# EAGLE design PiInTheSky-Mainboard-v0.5 (EAGLE 6.4)
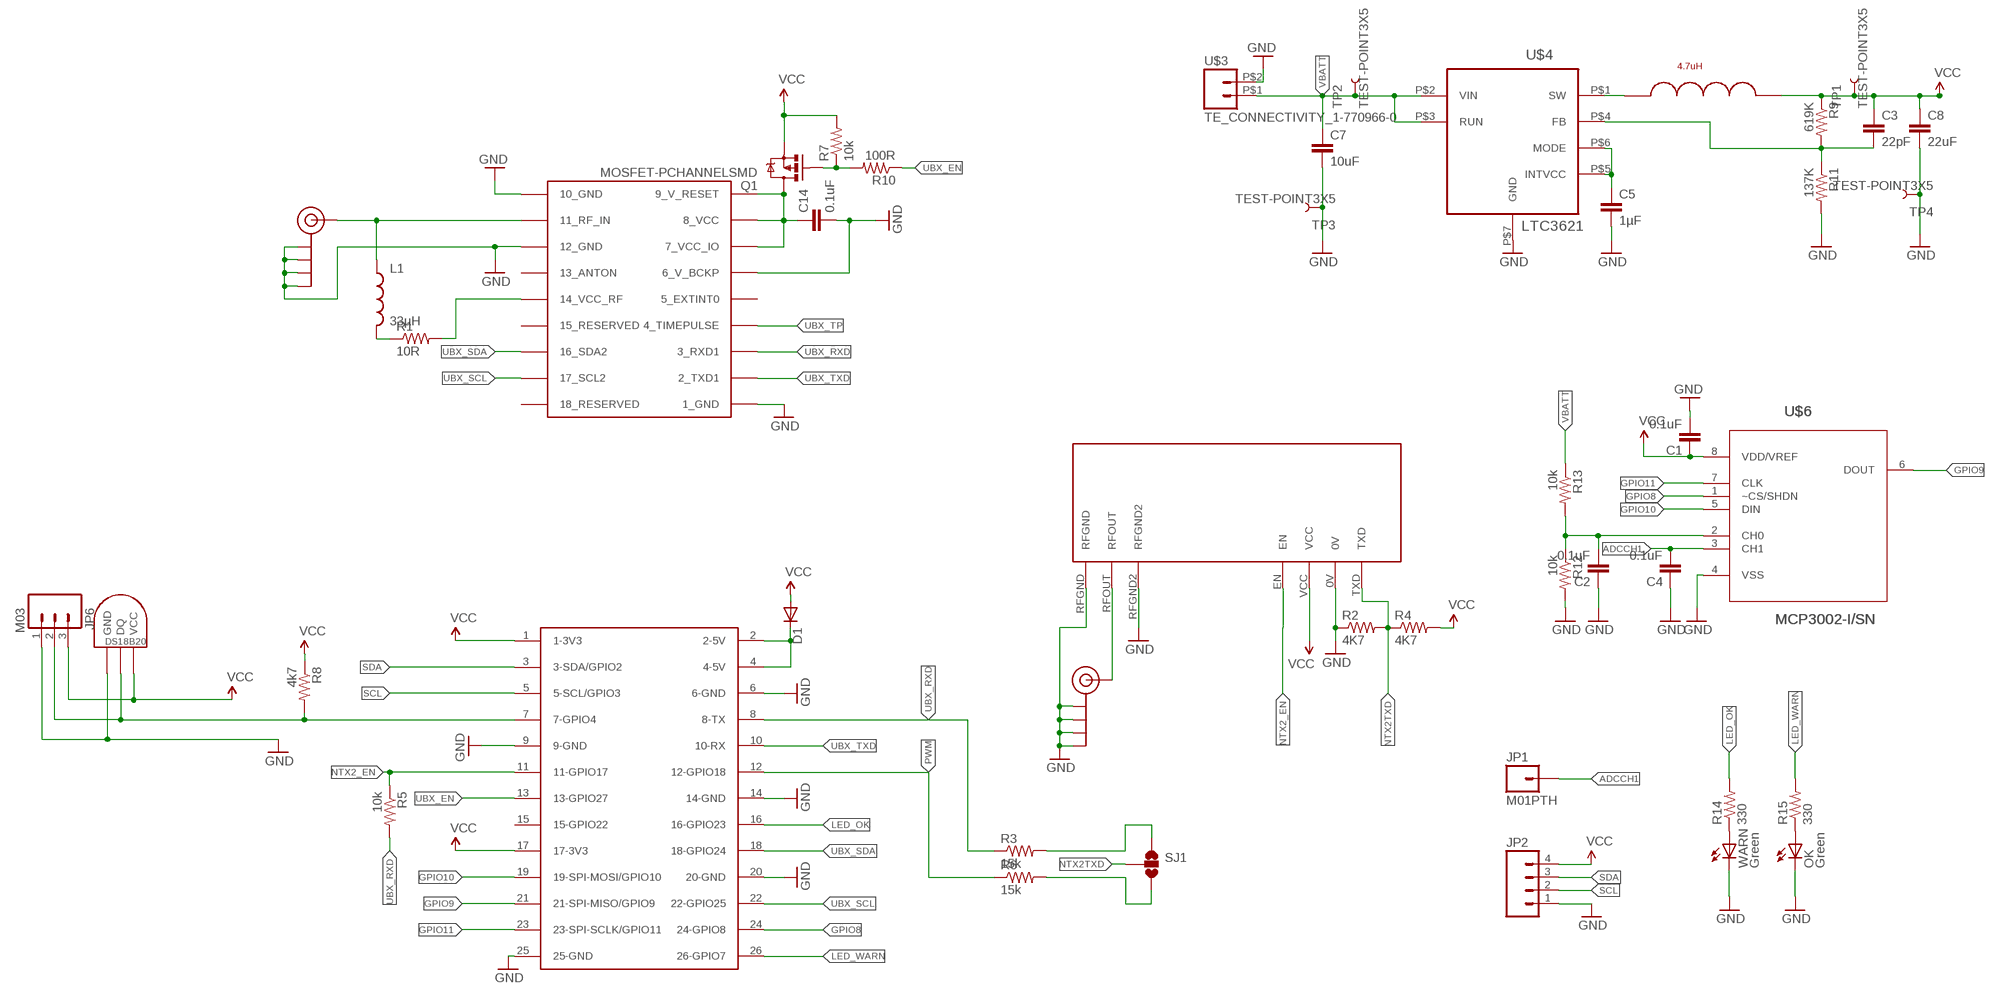
[diagram p0: schematic, sheet 1]

## Parts
C1  0.1uF  CAP0603-CAP  [0603-CAP]
C2  0.1uF  CAP0603-CAP  [0603-CAP]
C3  22pF  CAP0603-CAP  [0603-CAP]
C4  0.1uF  CAP0603-CAP  [0603-CAP]
C5  1µF  CAP0603-CAP  [0603-CAP]
C7  10uF  CAP1206  [1206]
C8  22uF  CAP1206  [1206]
C14  0.1uF  CAP0603-CAP  [0603-CAP]
D1  DIODESMA  [SMA-DIODE]
J$1  SMA_EDGE  [SMA-EDGE]
J$2  SMA_EDGE  [SMA-EDGE]
JP1  M01PTH  [1X01]
JP2  M04PTH  [1X04]
JP6  M03  [M03-JST]
L1  33µH  INDUCTOR0603  [0603]
NTX2TEMP  DS1821  DS1820SOIC  [DS18B20_SOIC]
OK  Green  LED0603  [LED-0603]
Q1  MOSFET-PCHANNELSMD  [SOT23-3]
R1  10R  RESISTOR0603-RES  [0603-RES]
R2  4K7  RESISTOR0603-RES  [0603-RES]
R3  15k  RESISTOR0603-RES  [0603-RES]
R4  4K7  RESISTOR0603-RES  [0603-RES]
R5  10k  RESISTOR0603-RES  [0603-RES]
R6  15k  RESISTOR0603-RES  [0603-RES]
R7  10k  RESISTOR0603-RES  [0603-RES]
R8  4k7  RESISTOR0603-RES  [0603-RES]
R9  619K  RESISTOR0603-RES  [0603-RES]
R10  100R  RESISTOR0603-RES  [0603-RES]
R11  137K  RESISTOR0603-RES  [0603-RES]
R12  10k  RESISTOR0603-RES  [0603-RES]
R13  10k  RESISTOR0603-RES  [0603-RES]
R14  330  RESISTOR0603-RES  [0603-RES]
R15  330  RESISTOR0603-RES  [0603-RES]
SJ1  SOLDERJUMPER_2WAY-OLDPASTE2&3  [SJ_3_PASTE2&3]
TP1  TEST-POINT3X5  [PAD.03X.05]
TP2  TEST-POINT3X5  [PAD.03X.05]
TP3  TEST-POINT3X5  [PAD.03X.05]
TP4  TEST-POINT3X5  [PAD.03X.05]
U$1  RASPBERRY-PIRPI-HEADERONLY  [RASPBERRY-PI-HEADERONLY]
U$2  NTX2  [NTX2]
U$3  TE_CONNECTIVITY_1-770966-0  [TE_CONNECTIVITY_1-770966-0]
U$4  LTC3621  [LTC_DWG_05-08-1715_REV_A]
U$5  4.7uH  COILCRAFT_LPS4018  [COILCRAFT_LPS4018]
U$6  MCP3002-I/SN  [SOIC127P600X175-8N]
U$7  UBLOX_MAX-6  [UBLOX_MAX-6]
WARN  Green  LED0603  [LED-0603]

## Nets
3.3V: D1.A ; supply symbol labelled VCC
ADCCH1: C4.2 JP1.1 U$6.3(CH1)
GND [vcc]: C1.2 C2.1 C4.1 C5.2 C7.2 C8.2 C14.2 J$1.GND@0(GND) J$1.GND@1(GND) J$1.GND@2(GND) J$1.GND@3(GND) J$2.GND@0(GND) J$2.GND@1(GND) J$2.GND@2(GND) J$2.GND@3(GND) JP2.1 JP6.1 NTX2TEMP.GND OK.C R2.1 R11.2 R12.2 TP3.P$1 TP4.P$1 U$1.6(6-GND) U$1.9(9-GND) U$1.14(14-GND) U$1.20(20-GND) U$1.25(25-GND) U$2.0V U$2.RFGND U$2.RFGND2 U$3.P$2 U$4.P$7(GND) U$6.4(VSS) U$7.1_GND U$7.6_V_BCKP U$7.10_GND U$7.12_GND WARN.C
GPIO1: JP6.2 NTX2TEMP.DQ R8.2 U$1.7(7-GPIO4)
GPIO8: U$1.24(24-GPIO8) U$6.1(~CS/SHDN)
GPIO9: U$1.21(21-SPI-MISO/GPIO9) U$6.6(DOUT)
GPIO10: U$1.19(19-SPI-MOSI/GPIO10) U$6.5(DIN)
GPIO11: U$1.23(23-SPI-SCLK/GPIO11) U$6.7(CLK)
LED_OK: R14.2 U$1.16(16-GPIO23)
LED_WARN: R15.2 U$1.26(26-GPIO7)
N$1: J$1.SIG(SIGNAL) L1.1 U$7.11_RF_IN
N$2: R1.2 U$7.14_VCC_RF
N$3: L1.2 R1.1
N$4: J$2.SIG(SIGNAL) U$2.RFOUT
N$5: U$4.P$1(SW) U$5.P$1
N$6: C2.2 R12.1 R13.2 U$6.2(CH0)
N$7: C14.1 Q1.3(D) U$7.7_VCC_IO U$7.8_VCC U$7.9_V_RESET
N$8: Q1.1(G) R7.1 R10.2
N$9: R3.2 SJ1.1
N$10: C3.2 R9.2 R11.1 U$4.P$4(FB)
N$11: C5.1 U$4.P$5(INTVCC) U$4.P$6(MODE)
N$12: OK.A R15.1
N$13: D1.C U$1.2(2-5V) U$1.4(4-5V)
N$15: R6.2 SJ1.3
N$17: R14.1 WARN.A
NTX2_EN: R5.1 U$1.11(11-GPIO17) U$2.EN
NTX2TXD: R2.2 R4.1 SJ1.2 U$2.TXD
PWM: R6.1 U$1.12(12-GPIO18)
SCL: JP2.2 U$1.5(5-SCL/GPIO3)
SDA: JP2.3 U$1.3(3-SDA/GPIO2)
UBX_EN: R10.1 U$1.13(13-GPIO27)
UBX_RXD: R3.1 R5.2 U$1.8(8-TX) U$7.3_RXD1
UBX_SCL: U$1.22(22-GPIO25) U$7.17_SCL2
UBX_SDA: U$1.18(18-GPIO24) U$7.16_SDA2
UBX_TP: U$7.4_TIMEPULSE
UBX_TXD: U$1.10(10-RX) U$7.2_TXD1
VBATT [vcc]: C7.1 R13.1 TP2.P$1 U$3.P$1 U$4.P$2(VIN) U$4.P$3(RUN)
VCC: C1.1 C3.1 C8.1 JP2.4 JP6.3 NTX2TEMP.VCC Q1.2(S) R4.2 R7.2 R8.1 R9.1 TP1.P$1 U$1.1(1-3V3) U$1.17(17-3V3) U$2.VCC U$5.P$2 U$6.8(VDD/VREF)
Unconnected: U$1.15(15-GPIO22) U$7.5_EXTINT0 U$7.13_ANTON U$7.15_RESERVED U$7.18_RESERVED

## Library data of the parts
C1-C5 C7 C8 C14 = SparkFun:CAP: Capacitor Standard 0603 ceramic capacitor, and 0.1" leaded capacitor.
D1 = SparkFun:DIODE: Diode These are standard reverse protection diodes and small signal diodes. SMA package can handle up to about 1A. SOD-323 can handle about 200mA. What the SOD-323 package when ordering, there are some mfgs out there that are 5-pin packages.
J$1 J$2 = SparkFun:SMA_EDGE: SMA Antenna Connector End launch SMA connector. The paste layer has been removed so that the connector can be hand soldered onto the board after reflow.
JP1 = SparkFun:M01: Header 1 Standard 1-pin 0.1" header. Use with straight break away headers (SKU : PRT-00116), right angle break away headers (PRT-00553), swiss pins (PRT-00743), machine pins (PRT-00117), and female headers (PRT-00115).
JP2 = SparkFun:M04: Header 4 Standard 4-pin 0.1" header. Use with straight break away headers (SKU : PRT-00116), right angle break away headers (PRT-00553), swiss pins (PRT-00743), machine pins (PRT-00117), and female headers (PRT-00115). Molex polarized connector foot print use with SKU : PRT-08231 with associated crimp pins and housings. 1MM SMD Version SKU: PRT-10208
JP6 = Ava:M03
L1 = SparkFun:INDUCTOR: Inductors Basic Inductor/Choke - 0603 and 1206. Footprints are not proven and vary greatly between part numbers.
NTX2TEMP = Ava:DS1820: DS18B20 Programmable Resolution 1-Wire Digital Thermometer Description The DS18B20 digital thermometer provides 9-bit to 12-bit Celsius temperature measurements and has an alarm function with nonvolatile user-programmable upper and lower trigger points. The DS18B20 communicates over a 1-Wire® bus that by definition requires only one data line (and ground) for communication with a central microprocessor. It has an operating temperature range of -55°C to +125°C and is accurate to ±0.5°C over the range of -10°C to +85°C. In addition, the DS18B20 can derive power directly from the data line ("parasite power"), eliminating the need for an external power supply. Each DS18B20 has a unique 64-bit serial code, which allows multiple DS18B20s to function on the same 1-Wire bus. Thus, it is simple to use one microprocessor to control many DS18B20s distributed over a large area. Applications that can benefit from this feature include HVAC environmental controls, temperature monitoring systems inside buildings, equipment, or machinery, and process monitoring and control systems.
OK WARN = SparkFun:LED: LEDs Standard schematic elements and footprints for 5mm, 3mm, 1206, and 0603 sized LEDs. 5mm - Spark Fun Electronics SKU : COM-00529 (and others)
Q1 = SparkFun:MOSFET-PCHANNEL
R1-R15 = SparkFun:RESISTOR: Resistor Basic schematic elements and footprints for 0603, 1206, and PTH resistors.
SJ1 = SparkFun:SOLDERJUMPER_2WAY-OLD: Solder Jumper 2 way solder jumper
TP1-TP4 = SparkFun:TEST-POINT
U$1 = RaspberryPi:RASPBERRY-PI: Raspberry Pi Board <http://www.raspberrypi.org/> Jacques Lagnel V1.0 (beta) 2012 Board dimension: Forum 3D model <http://www.raspberrypi.org/forum/general-discussion/mechanical-profile-3d-models?value=3d%20model&type=1&include=1&search=1&ret=all> The GPIO Connector (P1): http://elinux.org/RPi_Low-level_peripherals
U$2 = Ava:NTX2: Radiometrix NTX2 Transmitter Module Author Anthony Stirk / http://ava.upuaut.net
U$3 = Ava:TE_CONNECTIVITY_1-770966-0
U$4 = Ava:LTC3621
U$5 = StevesCoilCraft:COILCRAFT_LPS4018: CoilCraft LPS4018 series inductor
U$6 = Ava:MCP3002-I/SN: Dual Channel 10-Bit A/D Converter; DESCRIPTION: Dual Channel 10-Bit A/D Converter; MPN: MCP3002-I/SN; OC_FARNELL: 1834969; OC_NEWARK: 59K0225; PACKAGE: SOIC-8; SUPPLIER: Microchip
U$7 = Ava:UBLOX_MAX-6: UBLOX MAX-6

## Net classes
1 vcc: width 0.254 mm

## Board
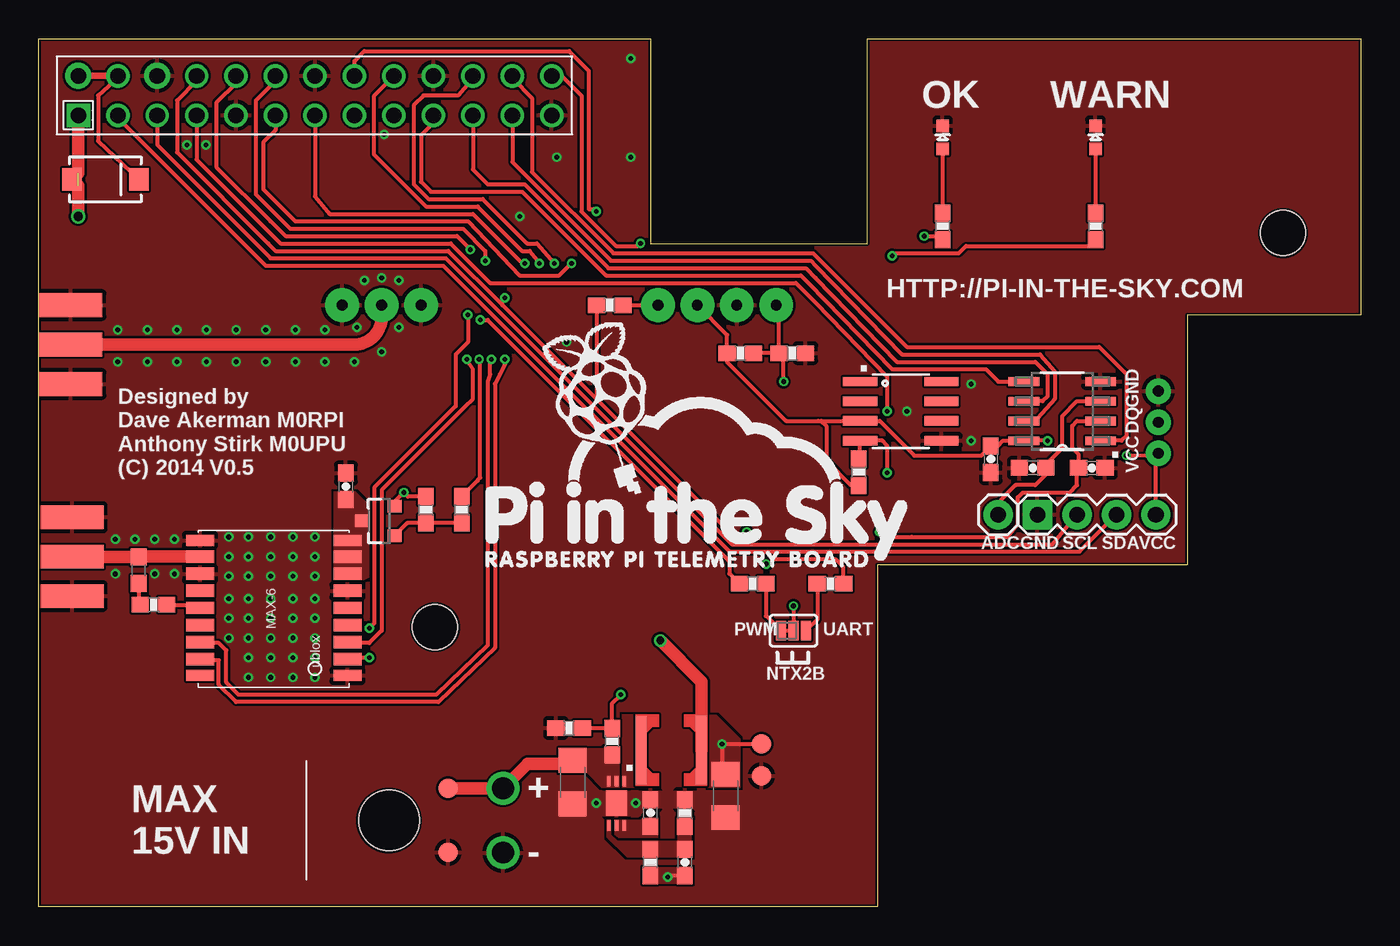
[diagram p1: board, top side]
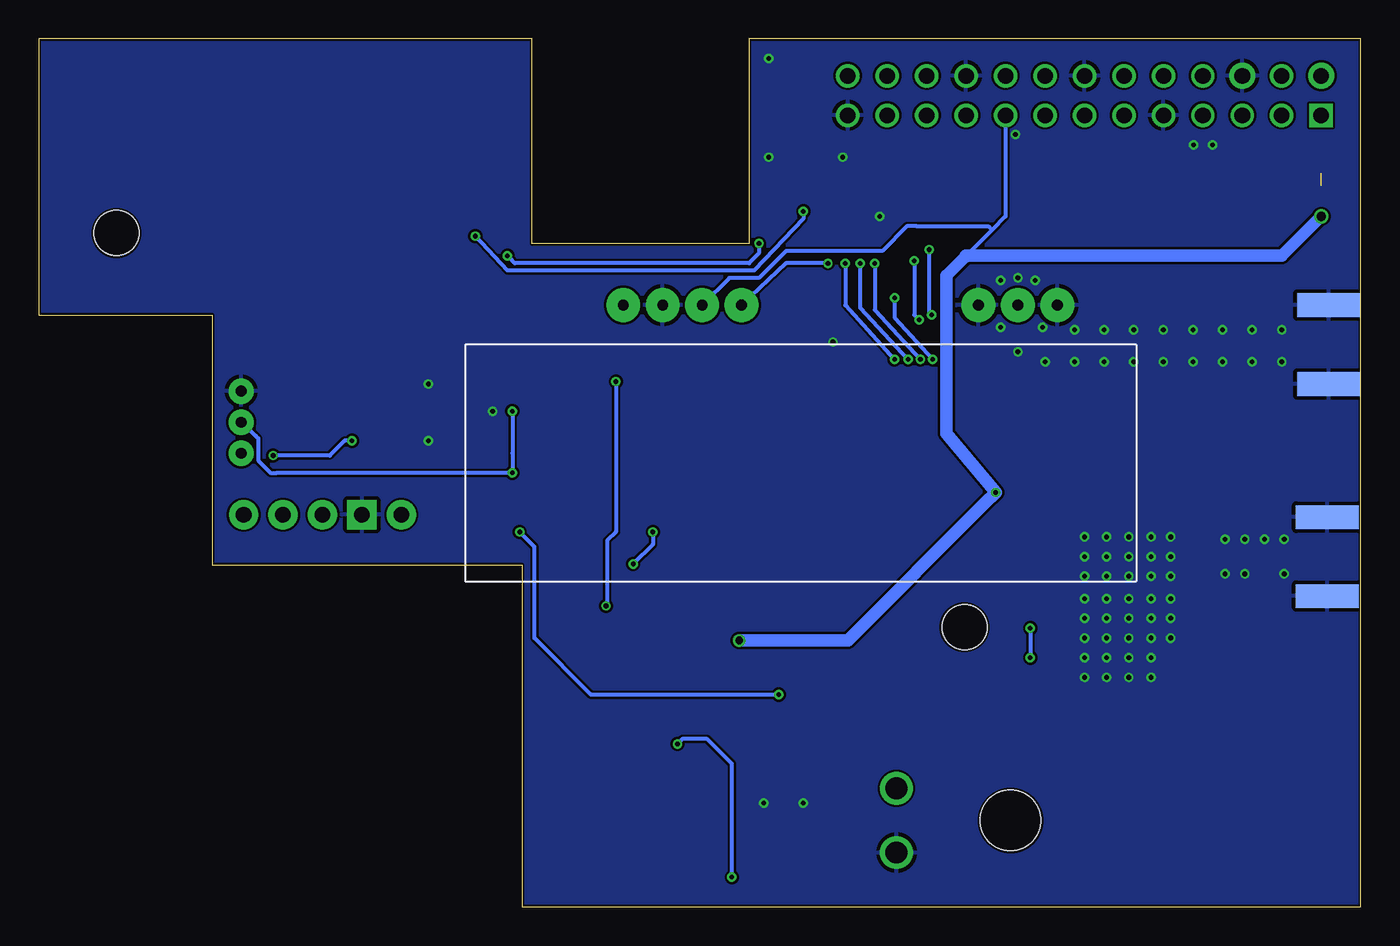
[diagram p2: board, bottom side, seen from below]

Size 85.09 x 55.88 mm. Coordinates in mm from the lower left corner, seen from the top.
Outline: 39.37,42.68 39.37,55.88 0,55.88 0,0 53.98,0 53.98,22 73.93,22 73.93,38.1 85.09,38.1 85.09,55.88 53.34,55.88 53.34,42.68 39.39,42.68
Copper layers (1*16): Top 0.035mm / dielectric 1.5mm / Bottom 0.035mm
Design rules "Hackvana": minimum track width 0.15mm, minimum drill 0.3mm, track to track 6mil, track to pad 6mil, pad to pad 6mil, via to via 6mil, smd to smd 0mil, copper to edge 6mil, drill to drill 6mil, minimum pad ring 10mil, minimum via ring 6mil, stop-mask expansion 2mil, vias tented up to drill 100mil, thermal gap 10mil
Holes 2.9 mm at 25.5,18 80.09,43.38

### Footprints (pad centres in the part's own frame; a part is rotated, then mirrored left to right if it is on the bottom)
0603-CAP = smd 1.1 x 1: 1 -0.85,0; 2 0.85,0
1206 = smd 1.6 x 1.8: 1 -1.4,0; 2 1.4,0
SMA-DIODE = smd 1.27 x 1.47: A -2.15,0; C 2.15,0
SMA-EDGE = smd 1.524 x 4.064: GND@0 -2.54,0; GND@1 2.54,0; SIG 0,0 | smd 1.524 x 4.064 bottom: GND@2 -2.54,0; GND@3 2.54,0
1X01 = drill 1.016 pad 1.88: 1 0,0
1X04 = drill 1.016 pad 1.88 square: 1 0,0 | drill 1.016 pad 1.88: 2 2.54,0; 3 5.08,0; 4 7.62,0
M03-JST = drill 0.7 pad 1.626: 1 -2,0.08; 2 0,0.08; 3 2,0.08
0603 = smd 1.1 x 1: 1 -0.85,0; 2 0.85,0
DS18B20_SOIC = smd 0.61 x 2.21: DQ 1.905,-2.616; GND 1.905,2.616; NC -1.905,-2.616; NC2 -0.635,-2.616; NC3 -1.905,2.616; NC4 -0.635,2.616; NC5 0.635,2.616; VCC 0.635,-2.616
LED-0603 = smd 0.8 x 0.8: A 0,-0.75; C 0,0.75
SOT23-3 = smd 0.8 x 0.9: 1 -0.95,-1; 2 0.95,-1; 3 0,1.1
0603-RES = smd 1.1 x 1: 1 -0.85,0; 2 0.85,0
SJ_3_PASTE2&3 = smd 0.635 x 1.27: 1 -0.813,0; 2 0,0; 3 0.813,0
PAD.03X.05 = smd 1.27 x 1.27: P$1 0,0
RASPBERRY-PI-HEADERONLY = drill 1 square: 1 -15.24,-1.27 | drill 1 pad 1.676: 2 -15.24,1.27; 6 -10.16,1.27 | drill 1: 3 -12.7,-1.27; 4 -12.7,1.27; 5 -10.16,-1.27; 7 -7.62,-1.27; 8 -7.62,1.27; 9 -5.08,-1.27; 10 -5.08,1.27; 11 -2.54,-1.27; 12 -2.54,1.27; 13 0,-1.27; 14 0,1.27; 15 2.54,-1.27; 16 2.54,1.27; 17 5.08,-1.27; 18 5.08,1.27; 19 7.62,-1.27; 20 7.62,1.27; 21 10.16,-1.27; 22 10.16,1.27; 23 12.7,-1.27; 24 12.7,1.27; 25 15.24,-1.27; 26 15.24,1.27
NTX2 = drill 0.7 pad 2.184: 0V -2.54,-10.16; EN -7.62,-10.16; RFGND -22.86,-10.16; RFGND2 -27.94,-10.16; RFOUT -25.4,-10.16; TXD 0,-10.16; VCC -5.08,-10.16
TE_CONNECTIVITY_1-770966-0 = drill 1.4: P$1 -2.07,7.34; P$2 2.07,7.34 | hole 3.9: 0,0
LTC_DWG_05-08-1715_REV_A = smd 0.25 x 0.7: P$1 -0.5,-1.425; P$2 0,-1.425; P$3 0.5,-1.425; P$4 0.5,1.425; P$5 0,1.425; P$6 -0.5,1.425 | smd 1.35 x 1.65: P$7 0,0
COILCRAFT_LPS4018 = smd 0.7 x 4.4: P$1 -1.95,0; P$2 1.95,0
SOIC127P600X175-8N = smd 1.981 x 0.559: 1 -2.464,1.905; 2 -2.464,0.635; 3 -2.464,-0.635; 4 -2.464,-1.905; 5 2.464,-1.905; 6 2.464,-0.635; 7 2.464,0.635; 8 2.464,1.905
UBLOX_MAX-6 = smd 1.8 x 0.7: 1_GND 4.95,-4.4; 9_V_RESET 4.95,4.3; 10_GND -4.55,4.3; 18_RESERVED -4.55,-4.4 | smd 1.8 x 0.8: 2_TXD1 4.95,-3.35; 3_RXD1 4.95,-2.25; 4_TIMEPULSE 4.95,-1.15; 5_EXTINT0 4.95,-0.05; 6_V_BCKP 4.95,1.05; 7_VCC_IO 4.95,2.15; 8_VCC 4.95,3.25; 11_RF_IN -4.55,3.25; 12_GND -4.55,2.15; 13_ANTON -4.55,1.05; 14_VCC_RF -4.55,-0.05; 15_RESERVED -4.55,-1.15; 16_SDA2 -4.55,-2.25; 17_SCL2 -4.55,-3.35

### Placement (x,y rotation side)
C1  61.28,28.81 270 top
C2  67.79,28.26 180 top
C3  41.59,2.86 90 top
C4  63.98,28.26 0 top
C5  39.37,6.03 90 top
C7  34.37,8.02 270 top
C8  44.21,7.14 270 top
C14  19.76,27.07 90 top
D1  4.29,46.83 0 top
J$1  2.14,22.54 270 top
J$2  2.06,36.2 270 top
JP1  61.75,25.24 0 top
JP2  64.29,25.24 0 top
JP6  71.99,31.19 270 top
L1  6.43,21.67 270 top
NTX2TEMP  55.48,31.91 270 top
OK  68.02,49.53 0 top
Q1  21.91,24.84 90 top
R1  7.38,19.45 0 top
R2  48.5,35.64 180 top
R3  50.96,20.8 180 top
R4  45.16,35.64 180 top
R5  36.75,38.73 180 top
R6  45.96,20.8 0 top
R7  24.92,25.56 90 top
R8  52.78,27.98 90 top
R9  39.37,2.86 90 top
R10  27.23,25.56 270 top
R11  41.59,6.03 90 top
R12  34.13,11.51 180 top
R13  36.91,10.64 90 top
R14  58.18,43.81 270 top
R15  68.02,43.81 270 top
SJ1  48.58,17.78 180 top
TP1  46.51,10.48 0 top
TP2  26.35,7.62 0 top
TP3  26.35,3.49 0 top
TP4  46.51,8.41 0 top
U$1  17.78,52.23 0 top
U$2  47.47,28.57 180 bottom
U$3  22.54,5.56 270 top
U$4  37.19,6.67 180 top
U$5  40.72,10.08 0 top
U$6  65.88,31.91 180 top
U$7  14.92,19.29 0 top
U$8  [PI_IN_SKY]  27.42,21.07 0 top
WARN  58.18,49.53 0 top

### Tracks (layer width: path | path; a pad name or v marks a point on that pad's centre or on a via)
ADCCH1
  Top 0.254: U$6.3 66.83,32.54 65.88,31.59 65.88,29.53 64.83,28.47 C4.2 64.83,27.84 64.14,27.15 62.87,27.15 61.59,25.88 61.59,25.32 61.67,25.32 JP1.1
GND  (via drill 0.3)
  other vias: 30.96,44.45 33.97,36.35 60.01,33.66 60.01,30 55.88,31.91 5.08,37.15 6.99,37.15 8.89,37.15 10.79,37.15 14.61,37.15 12.7,37.15 14.61,35.08 5.08,35.08 6.99,35.08 8.89,35.08 10.79,35.08 12.7,35.08 16.51,37.15 16.51,35.08 18.41,35.08 18.41,37.15 20.48,37.31 20.32,35.08 23.18,37.31 22.07,35.72 20.95,40.32 23.18,40.32 22.07,40.48 8.73,23.65 7.46,23.65 6.19,23.65 4.92,23.65 8.73,21.43 7.46,21.43 4.92,21.43 12.22,22.54 12.22,23.81 12.22,21.27 12.22,19.84 12.22,18.57 12.22,17.3 13.49,22.54 13.49,23.81 13.49,21.27 13.49,19.84 13.49,18.57 13.49,17.3 14.92,22.54 14.92,23.81 14.92,21.27 14.92,19.84 14.92,18.57 14.92,17.3 16.35,22.54 16.35,23.81 16.35,21.27 16.35,19.84 16.35,18.57 16.35,17.3 17.78,22.54 17.78,23.81 17.78,21.27 17.78,19.84 17.78,18.57 17.78,17.3 13.49,16.03 13.49,14.76 14.92,16.03 14.92,14.76 16.35,16.03 16.35,14.76 17.78,16.03 17.78,14.76 22.23,49.73 10.76,49.05 9.53,49.05 35.88,6.67 38.42,6.67 38.1,54.61 38.1,48.26 33.34,48.26
  pour Bottom (isolate 0.15): 0,55.88 39.37,55.88 39.37,42.86 53.34,42.86 53.34,55.88 85.09,56.2 85.09,38.1 73.98,38.1 73.98,22.23 53.98,22.23 53.98,0 0,0
  pour Top (isolate 0.15, rank 2): 0,55.88 39.37,55.88 39.37,42.86 53.34,42.86 53.34,55.88 85.09,56.2 85.09,38.1 73.98,38.1 73.98,22.23 53.98,22.23 53.98,0 0,0
  pour Top (no thermals): 33.3,7.78 35.36,7.78 35.64,7.5 36.08,7.5 44.73,7.46 45.48,6.71 45.48,4.8 45.32,4.64 42.66,4.64 42.55,4.76 42.55,5.87 42.11,6.31 38.85,6.35 38.85,6.07 38.7,5.83 35.72,5.83 35.36,5.48 33.14,5.48 33.14,7.74
GPIO1  (via drill 0.3)
  Top 0.254: U$1.7 10.16,48.1 14.76,43.5 15.56,42.7 26.51,42.7 29.05,40.16 48.74,40.16 50.01,38.89 54.61,34.13 v54.61,31.91 | v54.61,27.94 54.61,29.21 54.61,29.69 54.29,30 NTX2TEMP.DQ 52.87,28.83 R8.2
  Bottom 0.254: v54.61,31.91 54.61,29.21 v54.61,27.94 69.77,27.94 70.17,27.94 70.96,28.73 70.96,30.16 71.12,30.32 71.99,31.19 JP6.2
GPIO8
  Top 0.254: U$1.24 30.48,53.34 31.75,52.07 31.75,47.31 36.99,42.07 49.85,42.07 55.88,36.04 68.26,36.04 70.01,34.29 70.01,30.32 69.69,30 U$6.1
GPIO9
  Top 0.254: U$1.21 27.94,47.47 28.89,46.51 31.27,46.51 36.67,41.12 49.37,41.12 50.01,40.48 55.24,35.08 64.14,35.08 64.93,34.29 64.93,32.86 64.61,32.54 U$6.6
GPIO10
  Top 0.254: U$1.19 25.4,50.48 24.61,49.69 24.61,46.67 25.24,46.04 31.11,46.04 36.51,40.64 49.05,40.64 49.53,40.16 54.93,34.61 60.96,34.61 61.75,33.81 U$6.5
GPIO11
  Top 0.254: U$1.23 30.48,47.94 36.83,41.59 49.69,41.59 50.01,41.27 55.56,35.56 64.45,35.56 65.41,34.45 65.41,32.7 64.29,31.43 63.58,31.43 U$6.7
LED_OK  (via drill 0.3)
  Top 0.254: U$1.16 20.32,54.45 20.95,55.09 34.13,55.09 35.4,53.82 35.4,44.93 35.72,44.93 v35.88,44.77 | 58.13,43.02 R14.2 57.97,43.18 v56.99,43.18
  Bottom 0.254: v35.88,44.77 35.88,44.29 39.05,40.96 54.93,40.96 v56.99,43.18
LED_WARN  (via drill 0.3)
  Top 0.254: U$1.26 33.66,53.5 34.92,52.23 34.92,44.77 37.15,42.55 38.58,42.55 v38.73,42.7 | R15.2 67.6,42.55 59.69,42.55 59.21,42.07 57.15,42.07 55.09,42.07 v54.93,41.91
  Bottom 0.254: v38.73,42.7 38.73,42.07 39.37,41.43 54.45,41.43 54.61,41.59 v54.93,41.91
N$1
  Top 0.813: U$7.11_RF_IN 6.45,22.54 L1.1 2.17,22.52 J$1.SIG
N$2
  Top 0.254: R1.2 10.16,19.45 U$7.14_VCC_RF
N$3
  Top 0.254: L1.2 6.43,19.55 R1.1
N$4
  Top 0.813: U$2.RFOUT 22.07,37.94 arc-90 20.32,36.2 J$2.SIG
N$5
  pour Top (no thermals): 37.54,7.66 39.93,7.66 39.93,8.53 39.89,8.57 39.53,8.57 39.13,8.97 39.13,12.38 37.54,12.38
N$6  (via drill 0.3)
  Top 0.254: R12.1 35,11.49 R13.2 36.91,13.1 v37.47,13.65 | v54.13,24.13 54.45,24.13 54.61,23.81 56.2,23.81 62.39,23.81 63.02,24.61 63.02,26.35 63.34,26.67 66.36,26.67 66.83,27.15 66.83,28.16 C2.2 66.94,29.11 66.52,29.53 66.52,30.96 66.83,31.27 U$6.2
  Bottom 0.254: v37.47,13.65 49.53,13.65 53.18,17.3 53.18,23.18 v54.13,24.13
N$7
  pour Top (no thermals): 21.27,21.19 21.27,25.88 20.4,26.75 18.97,26.75 18.97,21.03 20.95,21.03
N$8
  Top 0.254: R10.2 R7.1 23.72,24.71 Q1.1
N$9
  Top 0.254: R3.2 50.11,18.5 SJ1.1
N$10
  pour Top (no thermals): 41.08,5.68 41.12,5.71 42.11,5.71
  pour Top (no thermals): 41.12,5.71 42.03,5.71 42.03,3.17 41.12,3.17
  pour Top (no thermals): 42.07,4.25 42.07,3.17 37.86,3.17 36.55,4.48 36.55,5.6 36.79,5.6 36.83,5.56 36.83,4.64 37.23,4.29 37.27,4.25
N$11
  pour Top (no thermals): 37.07,5.6 38.73,5.6 38.85,5.71 39.85,5.71 39.85,4.45 37.31,4.45 37.07,4.64
N$12
  Top 0.254: OK.A R15.1
N$13
  Top 0.254: 5.08,53.34 3.81,52.23 3.81,49.3 D1.C
  Top 0.406: U$1.2 U$1.4 5.08,53.34
N$14
  Top 0.254: 48.1,17.78 48.26,17.78
N$15
  Top 0.254: R6.2 46.81,18.71 46.84,18.71 SJ1.3
N$17
  Top 0.254: WARN.A R14.1
NTX2_EN  (via drill 0.3)
  Top 0.254: U$1.11 15.24,50.01 14.45,49.21 14.45,46.2 16.51,44.13 27.62,44.13 30.96,40.64 33.5,40.64 v34.29,41.43 | R5.1 U$2.EN
  Bottom 0.254: v34.29,41.43 36.99,41.43 U$2.EN
NTX2TXD  (via drill 0.3)
  Top 0.254: R2.2 47.65,38.55 U$2.TXD | v47.94,33.81 47.94,35.34 R2.2 | R2.2 R4.1 | v48.58,19.37 SJ1.2
  Bottom 0.254: v47.94,33.81 47.94,24.13 48.5,23.57 48.5,19.45 v48.58,19.37
PWM  (via drill 0.3)
  Top 0.254: U$1.12 15.24,53.18 13.97,51.91 13.97,45.88 15.08,44.77 16.19,43.66 27.3,43.66 28.73,42.23 v28.73,41.59 | v28.42,37.78 28.89,37.78 44.45,22.23 44.45,21.45 R6.1
  Bottom 0.254: v28.73,41.59 28.73,38.1 v28.42,37.78
SCL
  Top 0.254: U$1.5 7.62,49.05 14.92,41.75 26.19,41.75 44.61,23.34 65.25,23.34 JP2.2
SDA
  Top 0.254: U$1.3 5.08,50.8 14.61,41.27 26.04,41.27 44.45,22.86 66.99,22.86 JP2.3
UBX_EN  (via drill 0.3)
  Top 0.254: U$1.13 17.78,45.72 18.73,44.61 27.94,44.61 31.11,41.43 | 31.11,41.43 v31.27,41.43 31.11,41.43 | R10.1 28.26,27.44 28.26,27.46 28.42,27.62 28.42,35.08 v28.34,35.24
  Bottom 0.254: v31.27,41.43 31.27,38.42 v28.34,35.24
UBX_RXD  (via drill 0.3)
  Top 0.254: U$1.8 10.16,53.18 8.89,51.91 8.89,48.58 14.76,42.7 15.24,42.23 26.35,42.23 29.84,38.73 | 29.84,38.73 29.84,39.05 v30,39.21 | U$7.3_RXD1 19.92,16.99 21.27,16.99 22.07,17.78 22.07,26.83 27.46,32.23 27.94,32.7 27.94,34.61 v27.54,35.24 | R5.2 35.9,32.68 | 35.9,32.68 44.77,23.81 45.24,23.81 v45.56,24.13 | v46.83,22.07 46.99,22.07 47.31,22.38 48.52,22.38 51.28,22.38 51.75,21.91 51.75,20.85 R3.1 | 29.84,38.73 35.9,32.68
  Bottom 0.254: v30,39.21 30,37.94 v27.54,35.24 | v45.56,24.13 45.56,23.34 v46.83,22.07
UBX_SCL  (via drill 0.3)
  Top 0.254: U$1.22 27.94,53.34 26.99,52.23 24.77,52.23 24.13,51.59 24.13,46.51 25.08,45.56 28.57,45.56 31.43,42.7 32.07,42.7 v33.18,41.43 | 10.31,15.88 U$7.17_SCL2 10.44,15.88 11.59,15.88 11.59,14.29 12.7,13.18 25.72,13.18 29.37,16.67 29.37,33.66 29.69,34.29 30,34.92 30,35.16 v30,35.24
  Bottom 0.254: v33.18,41.43 33.18,38.73 v30,35.24
UBX_SDA  (via drill 0.3)
  Top 0.254: v32.23,41.43 31.59,42.23 31.11,42.23 28.26,45.09 24.92,45.09 23.97,46.04 23.81,46.2 21.59,48.42 21.59,52.23 U$1.18 | U$7.16_SDA2 10.42,16.99 11.59,16.99 12.06,16.51 12.06,14.45 12.86,13.65 25.56,13.65 28.89,16.83 28.89,17.62 28.89,33.81 29.05,34.29 29.05,35.16 v29.13,35.24
  Bottom 0.254: v32.23,41.43 32.23,38.58 v29.13,35.24
UBX_TXD  (via drill 0.3)
  Top 0.254: U$1.10 12.7,53.02 11.43,51.75 11.43,47.62 14.92,44.13 15.88,43.18 26.91,43.18 v27.78,42.31 | v27.62,38.1 27.62,36.35 26.83,35.56 26.83,33.34 26.83,32.23 21.59,26.99 21.59,18.26 v21.27,17.94 | v21.27,16.03 19.97,16.03 U$7.2_TXD1
  Bottom 0.254: v21.27,17.94 v21.27,16.03 | v27.78,42.31 27.78,38.26 v27.62,38.1
VBATT
  Top 0.813: 34.17,9.21 31.47,9.21 U$3.P$1 arc-90 U$3.P$1 TP2.P$1
  Top 1.016: 34.17,9.21 C7.1
  pour Top (no thermals): 37.39,10.32 37.39,7.66 36.23,7.66 35.28,8.61 33.5,8.61 33.5,10.2 36.31,10.2 36.43,10.32
VCC  (via drill 0.3, 0.5, 0.6)  (1 unrouted)
  Top 0.254: U$2.VCC 44.31,36.81 R4.2 44.31,35.06 48.1,31.27 50.16,31.27 50.36,31.27 | Q1.2 22.91,26.08 v23.5,26.67 23.76,26.41 R7.2 | C3.1 40.58,2.01 v40.48,1.91 | C8.1 43.97,8.78 v43.97,10.48 TP1.P$1 | 50.36,31.27 NTX2TEMP.VCC 54.13,31.27 56.36,29.05 60.67,29.05 C1.1 61.73,29.66 62.07,30 U$6.8 v64.93,30 | JP2.4 71.91,29.04 | 71.91,29.04 JP6.3 | 71.91,29.04 71.3,29.04 v70.01,29.05 | R8.1 52.28,27.13 50.72,28.69 50.72,30.92 50.36,31.27
  Top 0.813: U$5.P$2 42.67,14.48 v40.01,17.14 | v2.54,44.45 2.54,46.43 | U$1.1 2.54,47.23
  Bottom 0.254: U$1.17 22.86,44.45 23.73,43.58 | 23.73,43.58 25.48,41.83 | 23.73,43.58 23.97,43.81 28.57,43.81 29.21,43.81 30.8,42.23 36.99,42.23 38.73,40.48 40.64,40.48 U$2.VCC | v23.5,26.67 24.21,25.96 | v40.48,1.91 40.48,9.21 42.07,10.79 43.66,10.79 v43.97,10.48 | v64.93,30 65.41,30 66.36,29.05 v70.01,29.05
  Bottom 0.813: v40.01,17.14 33.02,17.14 24.21,25.96 v23.5,26.67 26.67,30.48 26.67,36.83 26.67,40.64 25.48,41.83 25.4,41.91 5.08,41.91 v2.54,44.45
  pour Top (no thermals): 41.51,7.66 45.16,7.66 45.16,10.79 43.62,12.34 42.47,12.34 42.35,12.22 42.35,9.01 41.91,8.57 41.51,8.57
  pour Top (no thermals): 38.89,2.54 42.07,2.54 42.07,1.47 38.89,1.47

### Text on the board
tPlace: OK | WARN | HTTP://PI-IN-THE-SKY.COM | . | GND | DQ | . | Designed by / Dave Akerman M0RPI / Anthony Stirk M0UPU / (C) 2014 V0.5 | VCC | ADC | GND | SCL | SDA | VCC | PWM | UART | NTX2B | . | + | MAX / 15V IN | -